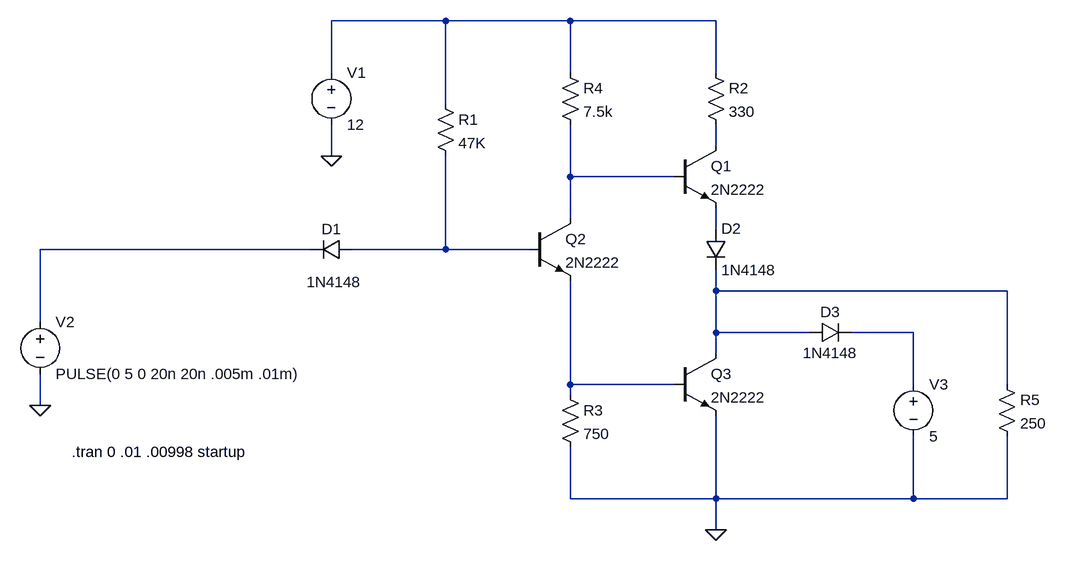
[diagram p0: schematic currentLoopDrive.asc]
currentLoopDrive.asc, the LTspice schematic file:
Version 4
SHEET 1 1248 680
WIRE -80 -544 -256 -544
WIRE 112 -544 -80 -544
WIRE 336 -544 112 -544
WIRE -256 -464 -256 -544
WIRE 112 -464 112 -544
WIRE 336 -464 336 -544
WIRE -80 -416 -80 -544
WIRE 336 -352 336 -384
WIRE -256 -336 -256 -384
WIRE 112 -304 112 -384
WIRE 272 -304 112 -304
WIRE 112 -240 112 -304
WIRE 336 -224 336 -256
WIRE -288 -192 -704 -192
WIRE -80 -192 -80 -336
WIRE -80 -192 -224 -192
WIRE 48 -192 -80 -192
WIRE 336 -128 336 -160
WIRE 784 -128 336 -128
WIRE -704 -80 -704 -192
WIRE 336 -64 336 -128
WIRE 480 -64 336 -64
WIRE 640 -64 544 -64
WIRE 336 -32 336 -64
WIRE 112 16 112 -144
WIRE 272 16 112 16
WIRE 640 16 640 -64
WIRE 784 16 784 -128
WIRE 112 32 112 16
WIRE -704 48 -704 0
WIRE 112 192 112 112
WIRE 336 192 336 64
WIRE 336 192 112 192
WIRE 640 192 640 96
WIRE 640 192 336 192
WIRE 784 192 784 96
WIRE 784 192 640 192
WIRE 336 240 336 192
FLAG 336 240 0
FLAG -256 -336 0
FLAG -704 48 0
SYMBOL diode 320 -224 R0
SYMATTR InstName D2
SYMATTR Value 1N4148
SYMBOL npn 272 -352 R0
SYMATTR InstName Q1
SYMATTR Value 2N2222
SYMBOL res -96 -432 R0
SYMATTR InstName R1
SYMATTR Value 47K
SYMBOL res 320 -480 R0
SYMATTR InstName R2
SYMATTR Value 330
SYMBOL res 96 16 R0
SYMATTR InstName R3
SYMATTR Value 750
SYMBOL res 96 -480 R0
SYMATTR InstName R4
SYMATTR Value 7.5k
SYMATTR SpiceLine tol=1 pwr=0.1
SYMBOL npn 48 -240 R0
SYMATTR InstName Q2
SYMATTR Value 2N2222
SYMBOL npn 272 -32 R0
SYMATTR InstName Q3
SYMATTR Value 2N2222
SYMBOL voltage -256 -480 R0
WINDOW 123 0 0 Left 2
WINDOW 39 0 0 Left 2
SYMATTR InstName V1
SYMATTR Value 12
SYMBOL voltage -704 -96 R0
WINDOW 123 0 0 Left 2
WINDOW 39 0 0 Left 2
SYMATTR InstName V2
SYMATTR Value PULSE(0 5 0 20n 20n .005m .01m)
SYMBOL res 768 0 R0
SYMATTR InstName R5
SYMATTR Value 250
SYMBOL diode -224 -208 R90
WINDOW 0 0 32 VBottom 2
WINDOW 3 51 28 VTop 2
SYMATTR InstName D1
SYMATTR Value 1N4148
SYMBOL voltage 640 0 R0
WINDOW 123 0 0 Left 2
WINDOW 39 0 0 Left 2
SYMATTR InstName V3
SYMATTR Value 5
SYMBOL diode 480 -48 R270
WINDOW 0 32 32 VTop 2
WINDOW 3 0 32 VBottom 2
SYMATTR InstName D3
SYMATTR Value 1N4148
TEXT -656 120 Left 2 !.tran 0 .01 .00998 startup

The netlist it stands for:
* currentLoopDrive.asc
D2 N004 N007 1N4148
Q1 N002 N003 N004 0 2N2222
R1 N001 N006 47K
R2 N001 N002 330
R3 N009 0 750
R4 N001 N003 7.5k tol=1 pwr=0.1
Q2 N003 N006 N009 0 2N2222
Q3 N007 N009 0 0 2N2222
V1 N001 0 12
V2 N005 0 PULSE(0 5 0 20n 20n .005m .01m)
R5 N007 0 250
D1 N006 N005 1N4148
V3 N008 0 5
D3 N007 N008 1N4148
.model D D
.lib standard.dio
.model NPN NPN
.model PNP PNP
.lib standard.bjt
.tran 0 .01 .00998 startup
.backanno
.end